# Altium schematic sheet power.SchDoc
size A
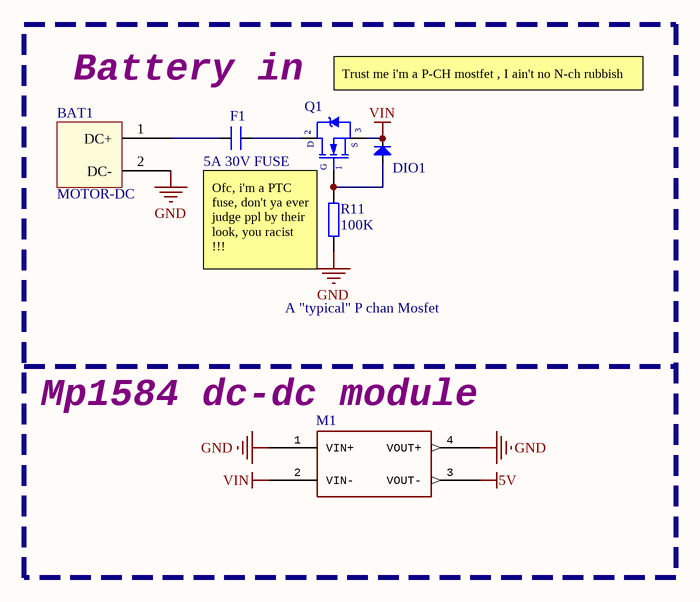
[diagram p0: power.SchDoc]

## Parts
BAT1  MOTOR-DC  [CON2-5.08DC]
DIO1  Diode SMD  [DIO-SMD-123]  (value not drawn)
F1  5A 30V FUSE  [CN2]
M1  MP1584-dc-brick-pcb Step down Input: 4.5V - 28V Ouput 0.8V - 25V max. 3A Cheap on ebay  [DC-BRICK]  (value not drawn)
Q1  A "typical" P chan Mosfet  [QTO-220]
R11  value 100K  [SMT0603]  (hidden comment: Resistor)

## Nets
5V: M1.3(VOUT-)
GND: BAT1.2(DC-) M1.1(VIN+) M1.4(VOUT+) R11.1
VIN: DIO1.2(K) M1.2(VIN-) Q1.3(S)
NetBAT1_1: BAT1.1(DC+) F1.1
NetDIO1_1: DIO1.1(A) Q1.1(G) R11.2
NetF1_2: F1.2 Q1.2(D)

## Notes on the sheet
- Battery in
- Trust me i'm a P-CH mostfet , I ain't no N-ch rubbish
- (near Q1) Ofc, i'm a PTC fuse, don't ya ever judge ppl by their look, you racist !!!
- (near M1) Mp1584 dc-dc module

## Library data of the parts
DIO1 = Diode SMD: Default Diode; Code - JEDEC: DO-214-AB; Value: 1N5007; Published: 8-Jun-2000; Revision: July-2002: Re-released for DXP Platform.; Publisher: Altium Limited
F1 = CN2: Cap np 104 => 105pF; Value: 0.1uF
M1 = MP1584
Q1 = IRF840: MOSFET N - CHANNEL 500V - 0.75 - 8A - TO-220; Value: IRF840
R11 = RES-SM-0603-100K: RES SM 0603 100K; Supplier 1: Farnell; Supplier 2: Digi-Key; Supplier Part Number 1: 1344361; Supplier Part Number 2: 541-100KHCT-ND